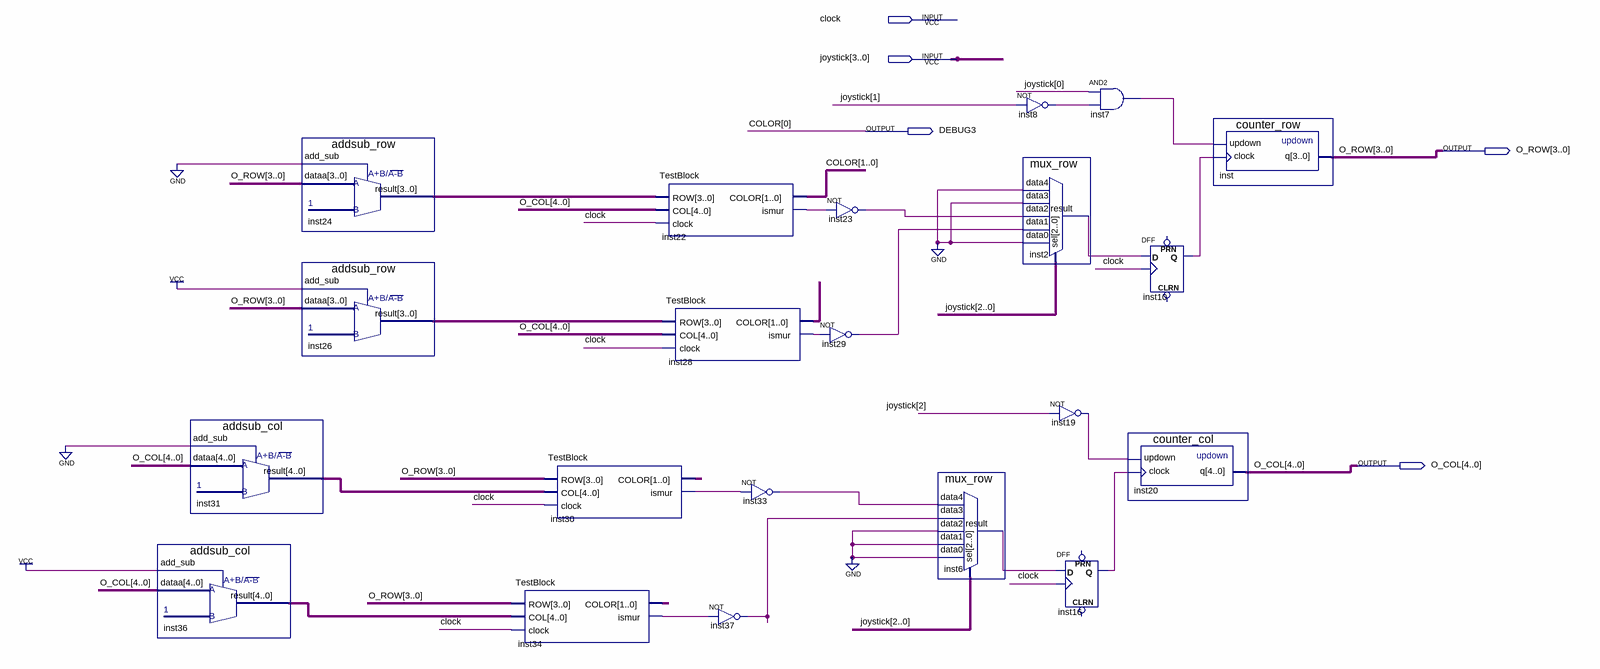
[diagram p0: schematic sheet]
// Quartus schematic Player.bdf as structural Verilog: 21 symbols, 5 pins
module Player (
  input  clock,
  input  [3:0] joystick,
  output DEBUG3,
  output [3:0] O_ROW,
  output [4:0] O_COL
);

  wire inst2_result, inst6_result, inst7_out, inst8_out, inst10_q, inst16_q, inst19_out, inst22_ismur,
       inst23_out, inst28_ismur, inst29_out, inst30_ismur, inst33_out, inst34_ismur, inst37_out;
  wire [1:0] inst28_color, inst30_color, inst34_color;
  wire [1:1] COLOR;
  wire [3:0] inst24_result, inst26_result;
  wire [4:0] inst31_result, inst36_result;

  addsub_col inst36 (.add_sub(1'b1), .dataa(O_COL), .result(inst36_result));
  addsub_col inst31 (.add_sub(1'b0), .dataa(O_COL), .result(inst31_result));
  addsub_row inst24 (.add_sub(1'b0), .dataa(O_ROW), .result(inst24_result));
  addsub_row inst26 (.add_sub(1'b1), .dataa(O_ROW), .result(inst26_result));
  TestBlock inst34 (.ROW(O_ROW), .COL(inst36_result), .clock(clock), .COLOR(inst34_color), .ismur(inst34_ismur));
  TestBlock inst30 (.ROW(O_ROW), .COL(inst31_result), .clock(clock), .COLOR(inst30_color), .ismur(inst30_ismur));
  TestBlock inst22 (.ROW(inst24_result), .COL(O_COL), .clock(clock), .COLOR({COLOR[1], DEBUG3}), .ismur(inst22_ismur));
  TestBlock inst28 (.ROW(inst26_result), .COL(O_COL), .clock(clock), .COLOR(inst28_color), .ismur(inst28_ismur));
  not inst33 (inst33_out, inst30_ismur);
  not inst37 (inst37_out, inst34_ismur);
  not inst23 (inst23_out, inst22_ismur);
  not inst29 (inst29_out, inst28_ismur);
  mux_row inst6 (
    .data4(inst33_out), .data3(inst37_out), .data2(1'b0), .data1(1'b0), .data0(1'b0), .sel(joystick[2:0]),
    .result(inst6_result));
  not inst8 (inst8_out, joystick[1]);
  mux_row inst2 (
    .data4(1'b0), .data3(1'b0), .data2(inst23_out), .data1(inst29_out), .data0(1'b0), .sel(joystick[2:0]),
    .result(inst2_result));
  not inst19 (inst19_out, joystick[2]);
  DFF inst16 (.CLK(clock), .D(inst6_result), .Q(inst16_q));  // open: CLRN, PRN
  and inst7 (inst7_out, joystick[0], inst8_out);
  DFF inst10 (.CLK(clock), .D(inst2_result), .Q(inst10_q));  // open: CLRN, PRN
  counter_col inst20 (.updown(inst19_out), .clock(inst16_q), .q(O_COL));
  counter_row inst (.updown(inst7_out), .clock(inst10_q), .q(O_ROW));

  // Other names for the same wires on the sheet: COLOR[0] = DEBUG3
endmodule
